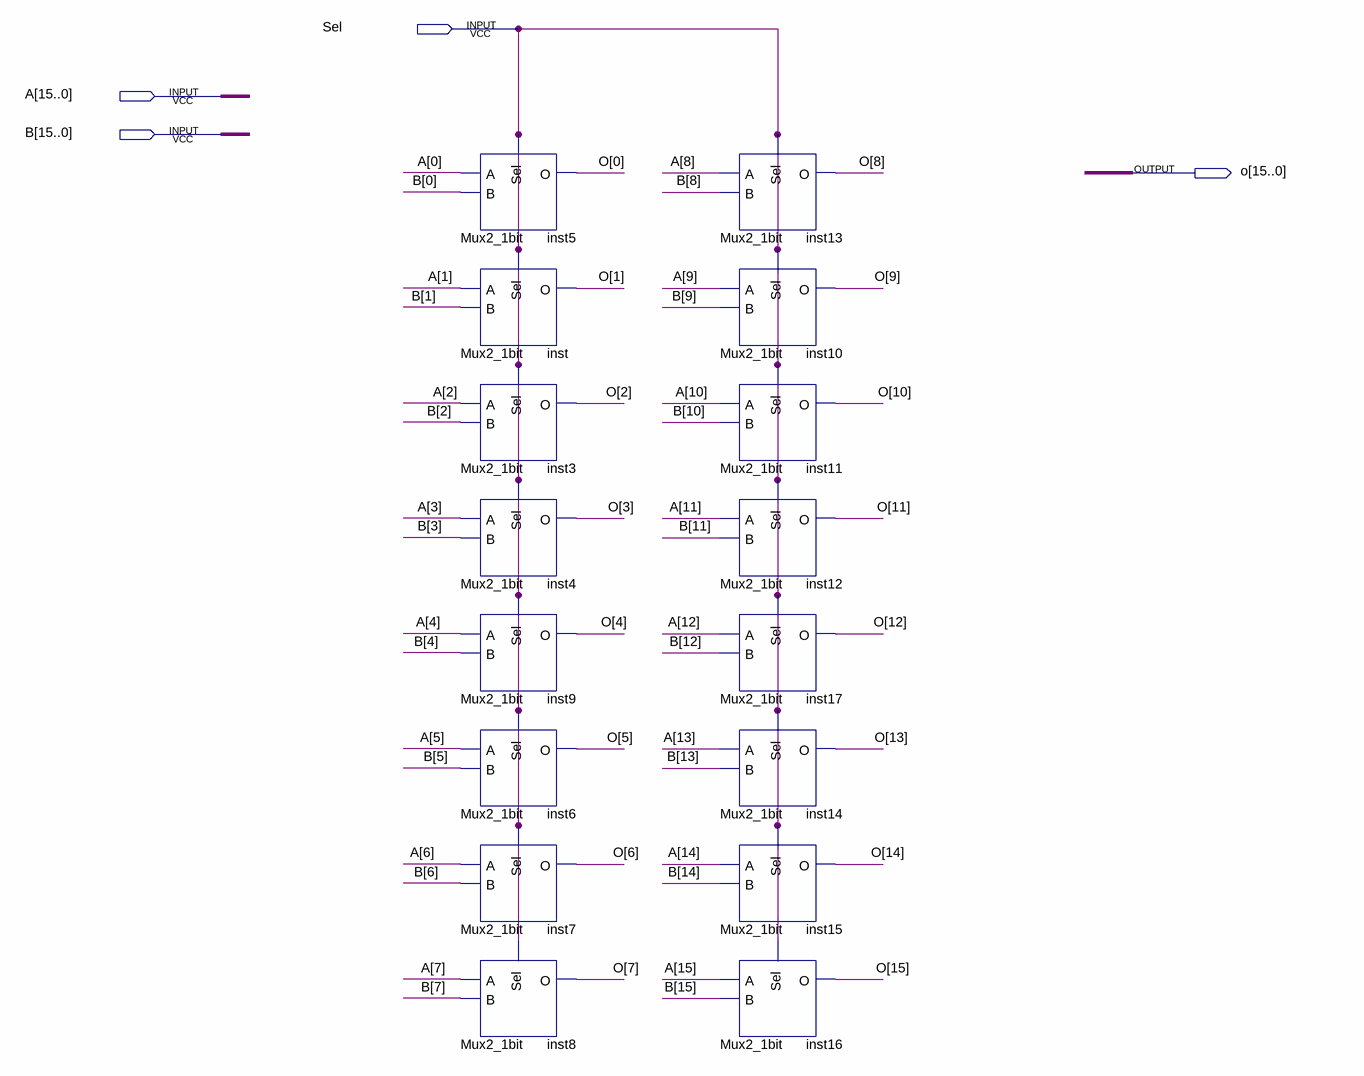
[diagram p0: schematic sheet]
// Quartus schematic Mux2_16bit.bdf as structural Verilog: 16 symbols, 4 pins
module Mux2_16bit (
  input  Sel,
  input  [15:0] A,
  input  [15:0] B,
  output [15:0] o
);

  Mux2_1bit inst5 (.A(A[0]), .B(B[0]), .Sel(Sel), .O(o[0]));
  Mux2_1bit inst (.A(A[1]), .B(B[1]), .Sel(Sel), .O(o[1]));
  Mux2_1bit inst3 (.A(A[2]), .B(B[2]), .Sel(Sel), .O(o[2]));
  Mux2_1bit inst4 (.A(A[3]), .B(B[3]), .Sel(Sel), .O(o[3]));
  Mux2_1bit inst9 (.A(A[4]), .B(B[4]), .Sel(Sel), .O(o[4]));
  Mux2_1bit inst6 (.A(A[5]), .B(B[5]), .Sel(Sel), .O(o[5]));
  Mux2_1bit inst7 (.A(A[6]), .B(B[6]), .Sel(Sel), .O(o[6]));
  Mux2_1bit inst8 (.A(A[7]), .B(B[7]), .Sel(Sel), .O(o[7]));
  Mux2_1bit inst13 (.A(A[8]), .B(B[8]), .Sel(Sel), .O(o[8]));
  Mux2_1bit inst10 (.A(A[9]), .B(B[9]), .Sel(Sel), .O(o[9]));
  Mux2_1bit inst11 (.A(A[10]), .B(B[10]), .Sel(Sel), .O(o[10]));
  Mux2_1bit inst12 (.A(A[11]), .B(B[11]), .Sel(Sel), .O(o[11]));
  Mux2_1bit inst17 (.A(A[12]), .B(B[12]), .Sel(Sel), .O(o[12]));
  Mux2_1bit inst14 (.A(A[13]), .B(B[13]), .Sel(Sel), .O(o[13]));
  Mux2_1bit inst15 (.A(A[14]), .B(B[14]), .Sel(Sel), .O(o[14]));
  Mux2_1bit inst16 (.A(A[15]), .B(B[15]), .Sel(Sel), .O(o[15]));
endmodule
